# Altium schematic sheet battery.SchDoc
size A
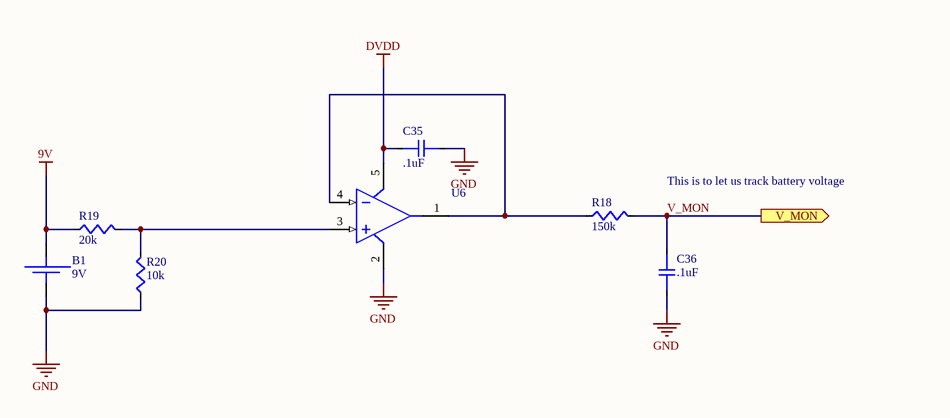
[diagram p0: battery.SchDoc]

## Parts
B1  9V  [HEADERPINS_2x1_Power]
C35  .1uF  [C0603]
C36  .1uF  [C0603]
R18  150k  [R0603]
R19  20k  [R0603]
R20  10k  [R0603]
U6  OPA325  [SOT-23-5-ALT]  (value not drawn)

## Ports
V_MON (out)

## Nets
9V: B1.+ R19.1
DVDD: C35.1 U6.5(VS+)
GND: B1.- C35.2 C36.1 R20.1 U6.2(VS-)
V_MON: C36.2 R18.2 ; port V_MON
NetR18_1: R18.1 U6.1(OUT) U6.4(-IN)
NetR19_2: R19.2 R20.2 U6.3(+IN)

## Notes on the sheet
- This is to let us track battery voltage

## Library data of the parts
B1 = 9V_BAT_conn_ 282837-2: Supplier 1: Digi-Key; Supplier Part Number 1: A113320-ND
C35 C36 = VJ0603Y104JXJCW1BC: 0603 0.1 uF 16 V ±5 % Tolerance X7R SMT Multilayer Ceramic Chip Capacitor; Manufacturer 1: Vishay Vitramon; Dielectric Material: Tantalum; Tolerance: 5%; Capacitance: 100nF; Voltage Rating: 16V; Supplier 1: Digi-Key; Supplier Part Number 1: 720-1685-1-ND; Manufacturer Part Number 1: VJ0603Y104JXJCW1BC; Stock 1: 6936; Pricing 1: 1=0.20000, 10=0.13400, 100=0.06780, 500=0.04636, 1000=0.04101 (USD); RoHS: Yes; Mount: Surface Mount; Case/Package: 0603; Number of Pins: 2; Case Code (Imperial): 0603; Case Code (Metric): 1608; Contact Plating: Tin,Matte; Min Operating Temperature: -55°C; Max Operating Temperature: 125°C; Packaging: Tape and Reel; Voltage Rating (DC): 16V; Package Quantity: 4000; Dielectric: X7R; Termination: SMD/SMT; Length: 1.6mm; Height: 0.95mm; Width: 0.8mm; Depth: 0.8mm; Lead Free: Lead Free; ComponentLink1URL: https://datasheet.ciiva.com/5424/vjw1bcbascomseries-223529-5424533.pdf?src-supplier=Mouser; ComponentLink1Description: https://datasheet.ciiva.com/5424/vjw1bcbascomseries-223529-5424533.pdf?src-supplier=Mouser; ComponentLink2URL: https://datasheet.ciiva.com/11491/vjw1bcbascomseries-11491768.pdf?src-supplier=Avnet; ComponentLink2Description: https://datasheet.ciiva.com/11491/vjw1bcbascomseries-11491768.pdf?src-supplier=Avnet; ComponentLink3URL: https://datasheet.ciiva.com/16215/vjw1bcbascomseries-16215161.pdf?src-supplier=Future+Electronics; ComponentLink3Description: https://datasheet.ciiva.com/16215/vjw1bcbascomseries-16215161.pdf?src-supplier=Future+Electronics
R18 = CRGCQ0603F150K: CRGCQ 0603 150K 1%; Manufacturer 1: Yageo; Manufacturer Part Number 1: RC0603JR-0710KL; Resistance: 10kR; Tolerance: 5%; Temperature Coefficient: 100ppm/°C; Voltage Rating (DC): 50V; Power Rating: 100mW; Supplier 1: Digi-Key; Stock 1: 22910838; Pricing 1: 1=0.10000, 10=0.01700, 100=0.00710, 1000=0.00318, 2500=0.00276 (USD); RoHS: Yes; Case/Package: 0603; Number of Pins: 2; Contact Plating: Tin,Matte; Case Code (Imperial): 0603; Case Code (Metric): 1608; Min Operating Temperature: -55°C; Max Operating Temperature: 155°C; Composition: Thick Film; Packaging: Tape and Reel; Voltage Rating: 50V; Termination: SMD/SMT; Military Standard: Not; Length: 1.6mm; Width: 0.8mm; Depth: 0.8mm; Radiation Hardening: No; REACH SVHC: Unknown; Lead Free: Lead Free; ComponentLink1URL: https://datasheet.ciiva.com/2452/pyu-rc0603-51-rohs-l-4-2452848.pdf?src-supplier=Digi-Key; ComponentLink1Description: https://datasheet.ciiva.com/2452/pyu-rc0603-51-rohs-l-4-2452848.pdf?src-supplier=Digi-Key; ComponentLink2URL: https://datasheet.ciiva.com/7746/443971-7746427.pdf?src-supplier=Element14; ComponentLink2Description: https://datasheet.ciiva.com/7746/443971-7746427.pdf?src-supplier=Element14; ComponentLink3URL: https://datasheet.ciiva.com/22747/443971-22747531.pdf?src-supplier=Element14; ComponentLink3Description: https://datasheet.ciiva.com/22747/443971-22747531.pdf?src-supplier=Element14; ComponentLink4URL: https://datasheet.ciiva.com/7746/443971-7746428.pdf?src-supplier=Element14; ComponentLink4Description: https://datasheet.ciiva.com/7746/443971-7746428.pdf?src-supplier=Element14; ComponentLink5URL: https://datasheet.ciiva.com/15189/getdatasheetpartid-327958-15189847.pdf?src-supplier=Verical; ComponentLink5Description: https://datasheet.ciiva.com/15189/getdatasheetpartid-327958-15189847.pdf?src-supplier=Verical; ComponentLink6URL: https://datasheet.ciiva.com/8883/pyu-rc0603-51-rohs-l-4-8883049.pdf?src-supplier=Avnet; ComponentLink6Description: https://datasheet.ciiva.com/8883/pyu-rc0603-51-rohs-l-4-8883049.pdf?src-supplier=Avnet; Supplier Part Number 1: 311-10KGRCT-ND
R19 = MCT06030E2002BP500: Res Thin Film 0603 20K Ohm 0.1% 0.1W(1/10W) ±15ppm/C Molded SMD Automotive Medical Paper T/R; Manufacturer 1: Vishay Semiconductors; Resistance: 20kR; Temperature Coefficient: 15ppm/°C; Supplier 1: Digi-Key; Manufacturer Part Number 1: MCT06030E2002BP500; Stock 1: 75960; Pricing 1: 1=0.70000, 10=0.58600, 100=0.39360, 1000=0.23128 (USD); RoHS: Yes; Case/Package: 0603; Contact Plating: Tin; Min Operating Temperature: -55°C; Max Operating Temperature: 125°C; Tolerance: 0.1%; Composition: Thin Film; Packaging: Tape and Reel; Military Standard: Not; Length: 1.55mm; Depth: 0.85mm; Radiation Hardening: No; Lead Free: Lead Free; ComponentLink1URL: https://datasheet.ciiva.com/17185/mc-pre-17185448.pdf?src-supplier=Avnet+Europe; ComponentLink1Description: https://datasheet.ciiva.com/17185/mc-pre-17185448.pdf?src-supplier=Avnet+Europe; ComponentLink2URL: https://datasheet.ciiva.com/8897/mc-pre-8897916.pdf?src-supplier=Avnet; ComponentLink2Description: https://datasheet.ciiva.com/8897/mc-pre-8897916.pdf?src-supplier=Avnet; Supplier Part Number 1: 749-1747-1-ND
R20 = RC0603JR-0710KL: RES SMD 10K OHM 5% 1/10W 0603
U6 = OPA325IDBVR: Manufacturer 1: Texas Instruments; Supplier 1: Digi-Key; Supplier Part Number 1: 296-OPA325IDBVRCT-ND; Manufacturer Part Number 1: OPA325IDBVR; Stock 1: 2034; Pricing 1: 1=1.69000, 10=1.51600, 25=1.43000, 100=1.14400, 250=1.00100, 500=0.97240, 1000=0.77220 (USD); RoHS: No